# Altium project Beagle_3V_SPI_Oled.PrjPCB
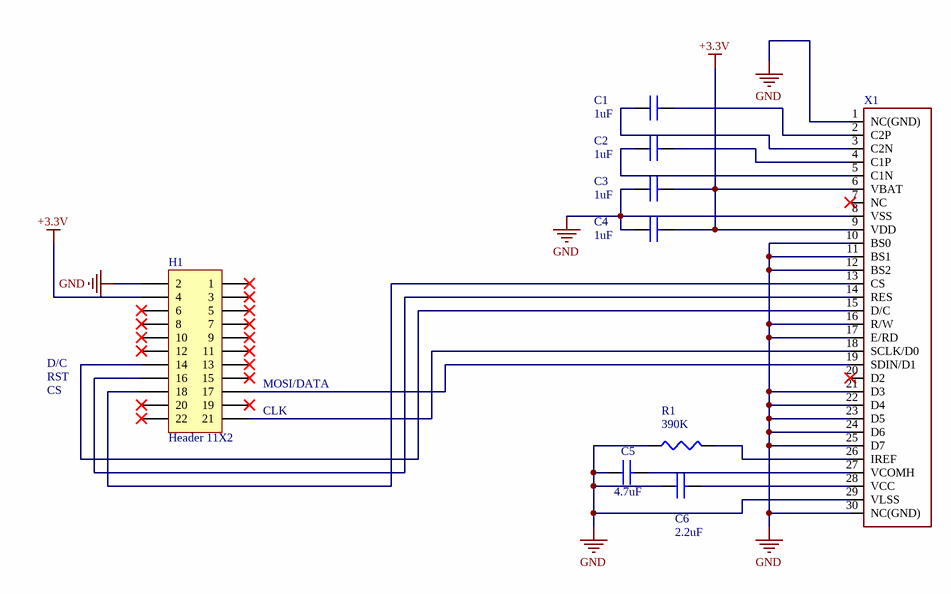
[diagram p0: Beagle_3V_SPI_Oled_Rev1.SchDoc]
PrjCustomer: Customer; PrjDrawnBy: XXX; PrjEngineer: XXX; PrjJobNumber: ####; PrjPartNUmber: ####-###-##; PrjRevision: #; PrjStartDate: YYYY/MM/DD; PrjTitle: Project Title; PrjTitle2: Project Title 2
1 sheet, 9 parts. Net scope: global (net labels, ports and power ports of the same name join across sheets).
Board file: Beagle_3V_SPI_Oled_Rev.PcbDoc

## Sheet Beagle_3V_SPI_Oled_Rev1.SchDoc
size A4; CompanyName: OMNITECH ELECTRONICS INCORPORATED; Organization: Omnitech Electronics Inc.; Address1: 1-10 Akerley Blvd, Dartmouth, Nova Scotia, Canada B3B 1J4; Address2: (902) 468-5911, FAX (902) 468-5912; Address3: www.omnitechelectronics.ca; SheetTotal: 5; PageSetup: Record=PageOptions|CenterHorizontal=True|CenterVertical=True|PrintScale=1.38|XCorrection=1.00|YCorrection=1.00|PrintKind=1|BorderSize=5000000|LeftOffset=0|BottomOffset=0|Orientation=2|PaperLength=1000|PaperWidth=1000|Scale=100|PaperSource=15|PrintQuality=600|MediaType=1|DitherType=10|PaperKind=11x17|PrintScaleMode=1

### Parts
C1  1uF  [CAPC1608X90N]
C2  1uF  [CAPC1608X90N]
C3  1uF  [CAPC1608X90N]
C4  1uF  [CAPC1608X90N]
C5  4.7uF  [CAPC1608X90N]
C6  2.2uF  [CAPC1608X90N]
H1  Header 11X2  [HDR2X11]
R1  390K  [RESC1608X55N]
X1  OLED_GLASS  [OLED_GLASS]  (value not drawn)

### Nets
+3.3V: C3.2 C4.2 H1.4 X1.6(VBAT) X1.9(VDD)
GND: C3.1 C4.1 C5.1 C6.1 H1.2 R1.1 X1.1(NC(GND)) X1.8(VSS) X1.10(BS0) X1.11(BS1) X1.12(BS2) X1.16(R/W) X1.17(E/RD) X1.21(D3) X1.22(D4) X1.23(D5) X1.24(D6) X1.25(D7) X1.29(VLSS) X1.30(NC(GND))
NetC1_1: C1.1 X1.3(C2N)
NetC1_2: C1.2 X1.2(C2P)
NetC2_1: C2.1 X1.5(C1N)
NetC2_2: C2.2 X1.4(C1P)
NetC5_2: C5.2 X1.27(VCOMH)
NetC6_2: C6.2 X1.28(VCC)
NetH1_14: H1.14 X1.15(D/C)
NetH1_16: H1.16 X1.14(RES)
NetH1_17: H1.17 X1.19(SDIN/D1)
NetH1_18: H1.18 X1.13(CS)
NetH1_21: H1.21 X1.18(SCLK/D0)
NetR1_2: R1.2 X1.26(IREF)

Not connected (* = marked no-connect by the designer): H1 1* 3* 5* 6* 7* 8* 9* 10* 11* 12* 13* 15* 19* 20* 22*; X1 7(NC)* 20(D2)*

### Notes on the sheet
- D/C
- RST
- CS
- (near H1) CLK
- (near H1) MOSI/DATA

### Library data of the parts
C1-C4 = CAP_0603: 1uf, 0603, X7R, 25V; PartNumber: GRM188R71E105KA12D; Manufacturer: Murata; Vendor: Digi-Key; Value: 1uF
C5 = CAP_0603: 4.7uf, 0603, X5R, 25V; PartNumber: GRM188R61E475KE11D; Manufacturer: Murata; Vendor: Digi-Key; Value: 4.7uF
C6 = CAP_0603: 2.2uf, 0603, X5R, 25V; PartNumber: GRM188R61E225KA12D; Manufacturer: Murata; Vendor: Digi-Key; Value: 2.2uF
H1 = Header 11X2: 22 Position Header Connector 0.100"; Manufacturer: Sullins; PartNumber: PPTC112LFBN-RC; Vendor: Digi-Key
R1 = RES_0603: RES SMD 390K OHM 1% 1/10W 0603; Manufacturer: Panasonic; PartNumber: ERJ-3EKF3903V; Vendor: Digi-Key; Value: 390K
X1 = OLED_GLASS: PartNumber: ER-OLED0.96-1W; Manufacturer: Buy-Display; Vendor: Buy-Display